# Altium schematic sheet Sch_BaseBoard.SchDoc: Control de Domótica
size A4; Author: Francisco González González - Eugenia Ipar; CompanyName: Interconexión de la Baseboard; Organization: Altium Limited; Address1: L3, 12a Rodborough Rd; Address2: Frenchs Forest; Address3: NSW; Address4: Australia 2086; DocumentNumber: 1; SheetNumber: 1; SheetTotal: 12; Materia: Técnicas Digitales II; Year: 2015; Placa: Base Board; Prof1: Prof: Alarcón, Juan; Prof2: Ayud: Crivelli, Marcelo; Prof3: Ayud: Montalti, Pablo
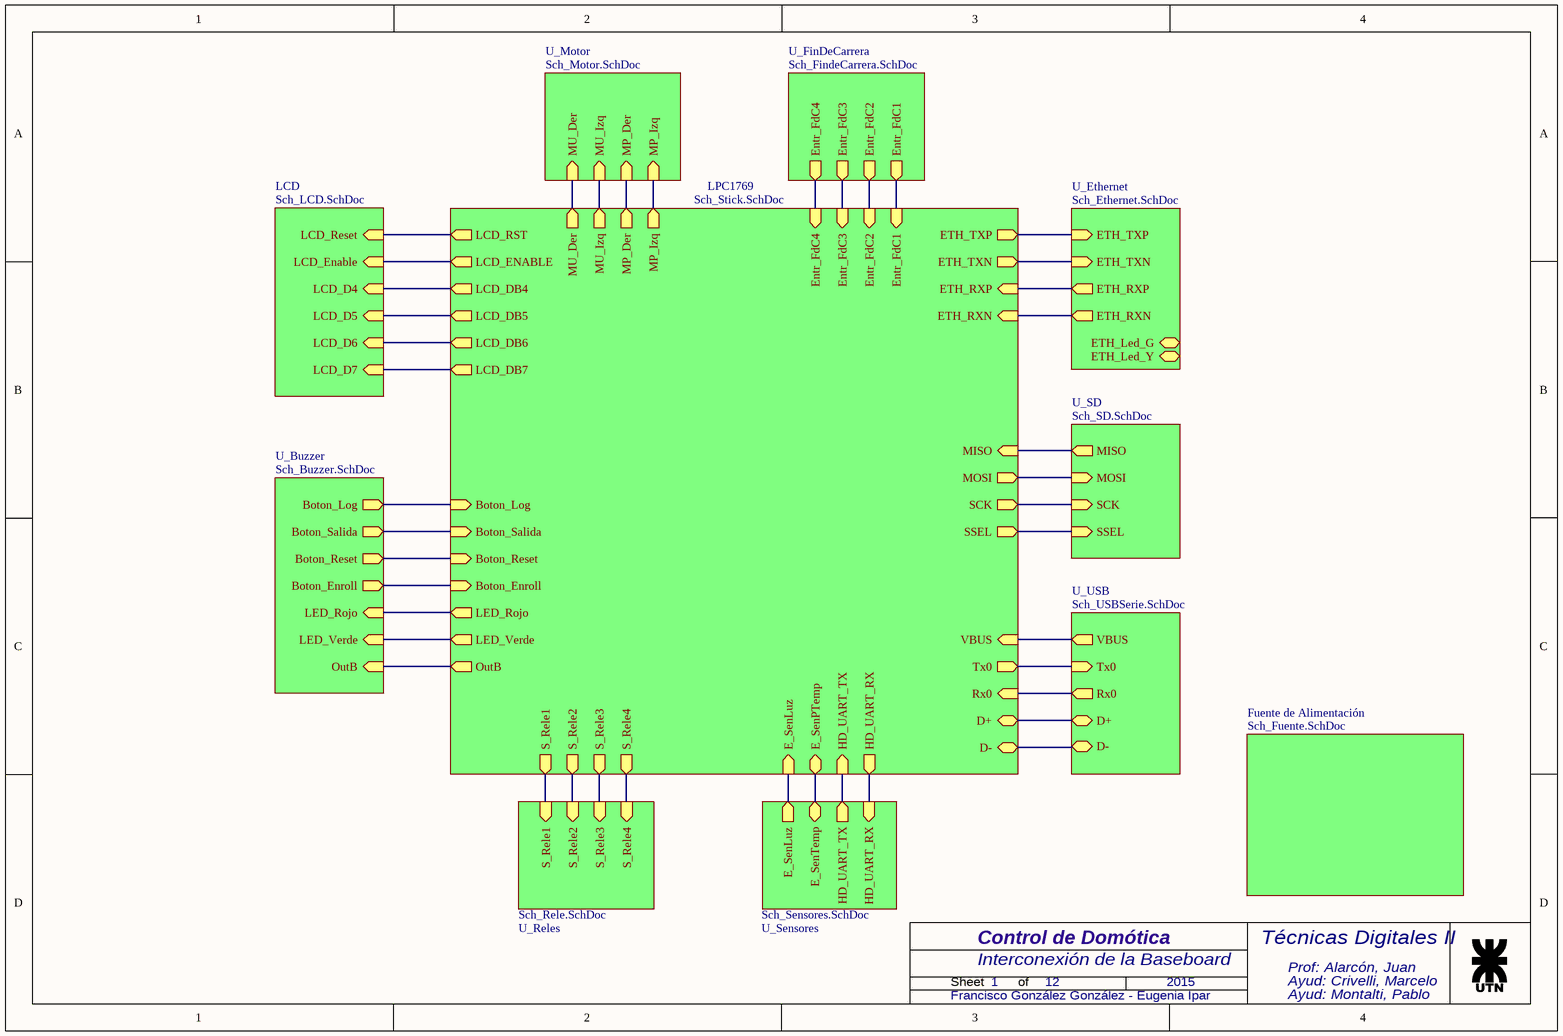
[diagram p0: Sch_BaseBoard.SchDoc]

## Sub-sheets
Fuente de Alimentación = Sch_Fuente.SchDoc: no entries
LCD = Sch_LCD.SchDoc: LCD_Reset (in), LCD_Enable (in), LCD_D4 (in), LCD_D5 (in), LCD_D6 (in), LCD_D7 (in)
LPC1769 = Sch_Stick.SchDoc: Entr_FdC1 (in), Entr_FdC2 (in), Entr_FdC3 (in), OutB (out), E_SenPTemp (bidir), HD_UART_TX (in), MISO (in), MOSI (out), SCK (out), SSEL (out), Tx0 (out), Rx0 (in), ETH_TXP (out), ETH_TXN (out), ETH_RXP (in), ETH_RXN (in), MP_Izq (out), MP_Der (out), MU_Izq (out), MU_Der (out), D+ (bidir), Entr_FdC4 (in), LCD_RST (out), LCD_ENABLE (out), LCD_DB4 (out), LCD_DB5 (out), LCD_DB6 (out), LCD_DB7 (out), LED_Verde (out), LED_Rojo (out), Boton_Enroll (in), Boton_Reset (in), Boton_Salida (in), S_Rele1 (out), S_Rele2 (out), S_Rele3 (out), S_Rele4 (out), D- (bidir), HD_UART_RX (out), E_SenLuz (in), VBUS (in), Boton_Log (in)
U_Buzzer = Sch_Buzzer.SchDoc: OutB (in), LED_Rojo (in), Boton_Enroll (out), Boton_Reset (out), Boton_Salida (out), LED_Verde (in), Boton_Log (out)
U_Ethernet = Sch_Ethernet.SchDoc: ETH_TXP (in), ETH_TXN (in), ETH_RXP (out), ETH_RXN (out), ETH_Led_G, ETH_Led_Y
U_FinDeCarrera = Sch_FindeCarrera.SchDoc: Entr_FdC1 (out), Entr_FdC2 (out), Entr_FdC3 (out), Entr_FdC4 (out)
U_Motor = Sch_Motor.SchDoc: MP_Izq (in), MP_Der (in), MU_Izq (in), MU_Der (in)
U_Reles = Sch_Rele.SchDoc: S_Rele1 (in), S_Rele2 (in), S_Rele3 (in), S_Rele4 (in)
U_SD = Sch_SD.SchDoc: MISO (out), MOSI (in), SSEL (in), SCK (in)
U_Sensores = Sch_Sensores.SchDoc: E_SenLuz (out), E_SenTemp (bidir), HD_UART_TX (out), HD_UART_RX (in)
U_USB = Sch_USBSerie.SchDoc: Tx0 (in), Rx0 (out), D+ (bidir), D- (bidir), VBUS (out)

## Nets
(unnamed): sheet LPC1769/Entr_FdC1, sheet U_FinDeCarrera/Entr_FdC1
(unnamed): sheet LPC1769/Entr_FdC2, sheet U_FinDeCarrera/Entr_FdC2
(unnamed): sheet LPC1769/Entr_FdC3, sheet U_FinDeCarrera/Entr_FdC3
(unnamed): sheet LPC1769/OutB, sheet U_Buzzer/OutB
(unnamed): sheet LPC1769/E_SenPTemp, sheet U_Sensores/E_SenTemp
(unnamed): sheet LPC1769/HD_UART_TX, sheet U_Sensores/HD_UART_TX
(unnamed): sheet LPC1769/MISO, sheet U_SD/MISO
(unnamed): sheet LPC1769/MOSI, sheet U_SD/MOSI
(unnamed): sheet LPC1769/SCK, sheet U_SD/SCK
(unnamed): sheet LPC1769/SSEL, sheet U_SD/SSEL
(unnamed): sheet LPC1769/Tx0, sheet U_USB/Tx0
(unnamed): sheet LPC1769/Rx0, sheet U_USB/Rx0
(unnamed): sheet LPC1769/ETH_TXP, sheet U_Ethernet/ETH_TXP
(unnamed): sheet LPC1769/ETH_TXN, sheet U_Ethernet/ETH_TXN
(unnamed): sheet LPC1769/ETH_RXP, sheet U_Ethernet/ETH_RXP
(unnamed): sheet LPC1769/ETH_RXN, sheet U_Ethernet/ETH_RXN
(unnamed): sheet LPC1769/MP_Izq, sheet U_Motor/MP_Izq
(unnamed): sheet LPC1769/MP_Der, sheet U_Motor/MP_Der
(unnamed): sheet LPC1769/MU_Izq, sheet U_Motor/MU_Izq
(unnamed): sheet LPC1769/MU_Der, sheet U_Motor/MU_Der
(unnamed): sheet LPC1769/D+, sheet U_USB/D+
(unnamed): sheet LPC1769/Entr_FdC4, sheet U_FinDeCarrera/Entr_FdC4
(unnamed): sheet LPC1769/LCD_RST, sheet LCD/LCD_Reset
(unnamed): sheet LPC1769/LCD_ENABLE, sheet LCD/LCD_Enable
(unnamed): sheet LPC1769/LCD_DB4, sheet LCD/LCD_D4
(unnamed): sheet LPC1769/LCD_DB5, sheet LCD/LCD_D5
(unnamed): sheet LPC1769/LCD_DB6, sheet LCD/LCD_D6
(unnamed): sheet LPC1769/LCD_DB7, sheet LCD/LCD_D7
(unnamed): sheet LPC1769/LED_Verde, sheet U_Buzzer/LED_Verde
(unnamed): sheet LPC1769/LED_Rojo, sheet U_Buzzer/LED_Rojo
(unnamed): sheet LPC1769/Boton_Enroll, sheet U_Buzzer/Boton_Enroll
(unnamed): sheet LPC1769/Boton_Reset, sheet U_Buzzer/Boton_Reset
(unnamed): sheet LPC1769/Boton_Salida, sheet U_Buzzer/Boton_Salida
(unnamed): sheet LPC1769/S_Rele1, sheet U_Reles/S_Rele1
(unnamed): sheet LPC1769/S_Rele2, sheet U_Reles/S_Rele2
(unnamed): sheet LPC1769/S_Rele3, sheet U_Reles/S_Rele3
(unnamed): sheet LPC1769/S_Rele4, sheet U_Reles/S_Rele4
(unnamed): sheet LPC1769/D-, sheet U_USB/D-
(unnamed): sheet LPC1769/HD_UART_RX, sheet U_Sensores/HD_UART_RX
(unnamed): sheet LPC1769/E_SenLuz, sheet U_Sensores/E_SenLuz
(unnamed): sheet LPC1769/VBUS, sheet U_USB/VBUS
(unnamed): sheet LPC1769/Boton_Log, sheet U_Buzzer/Boton_Log

## Notes on the sheet
- Sheet
- of